# EAGLE design LPC_4TE_4.03 (EAGLE 5.04)
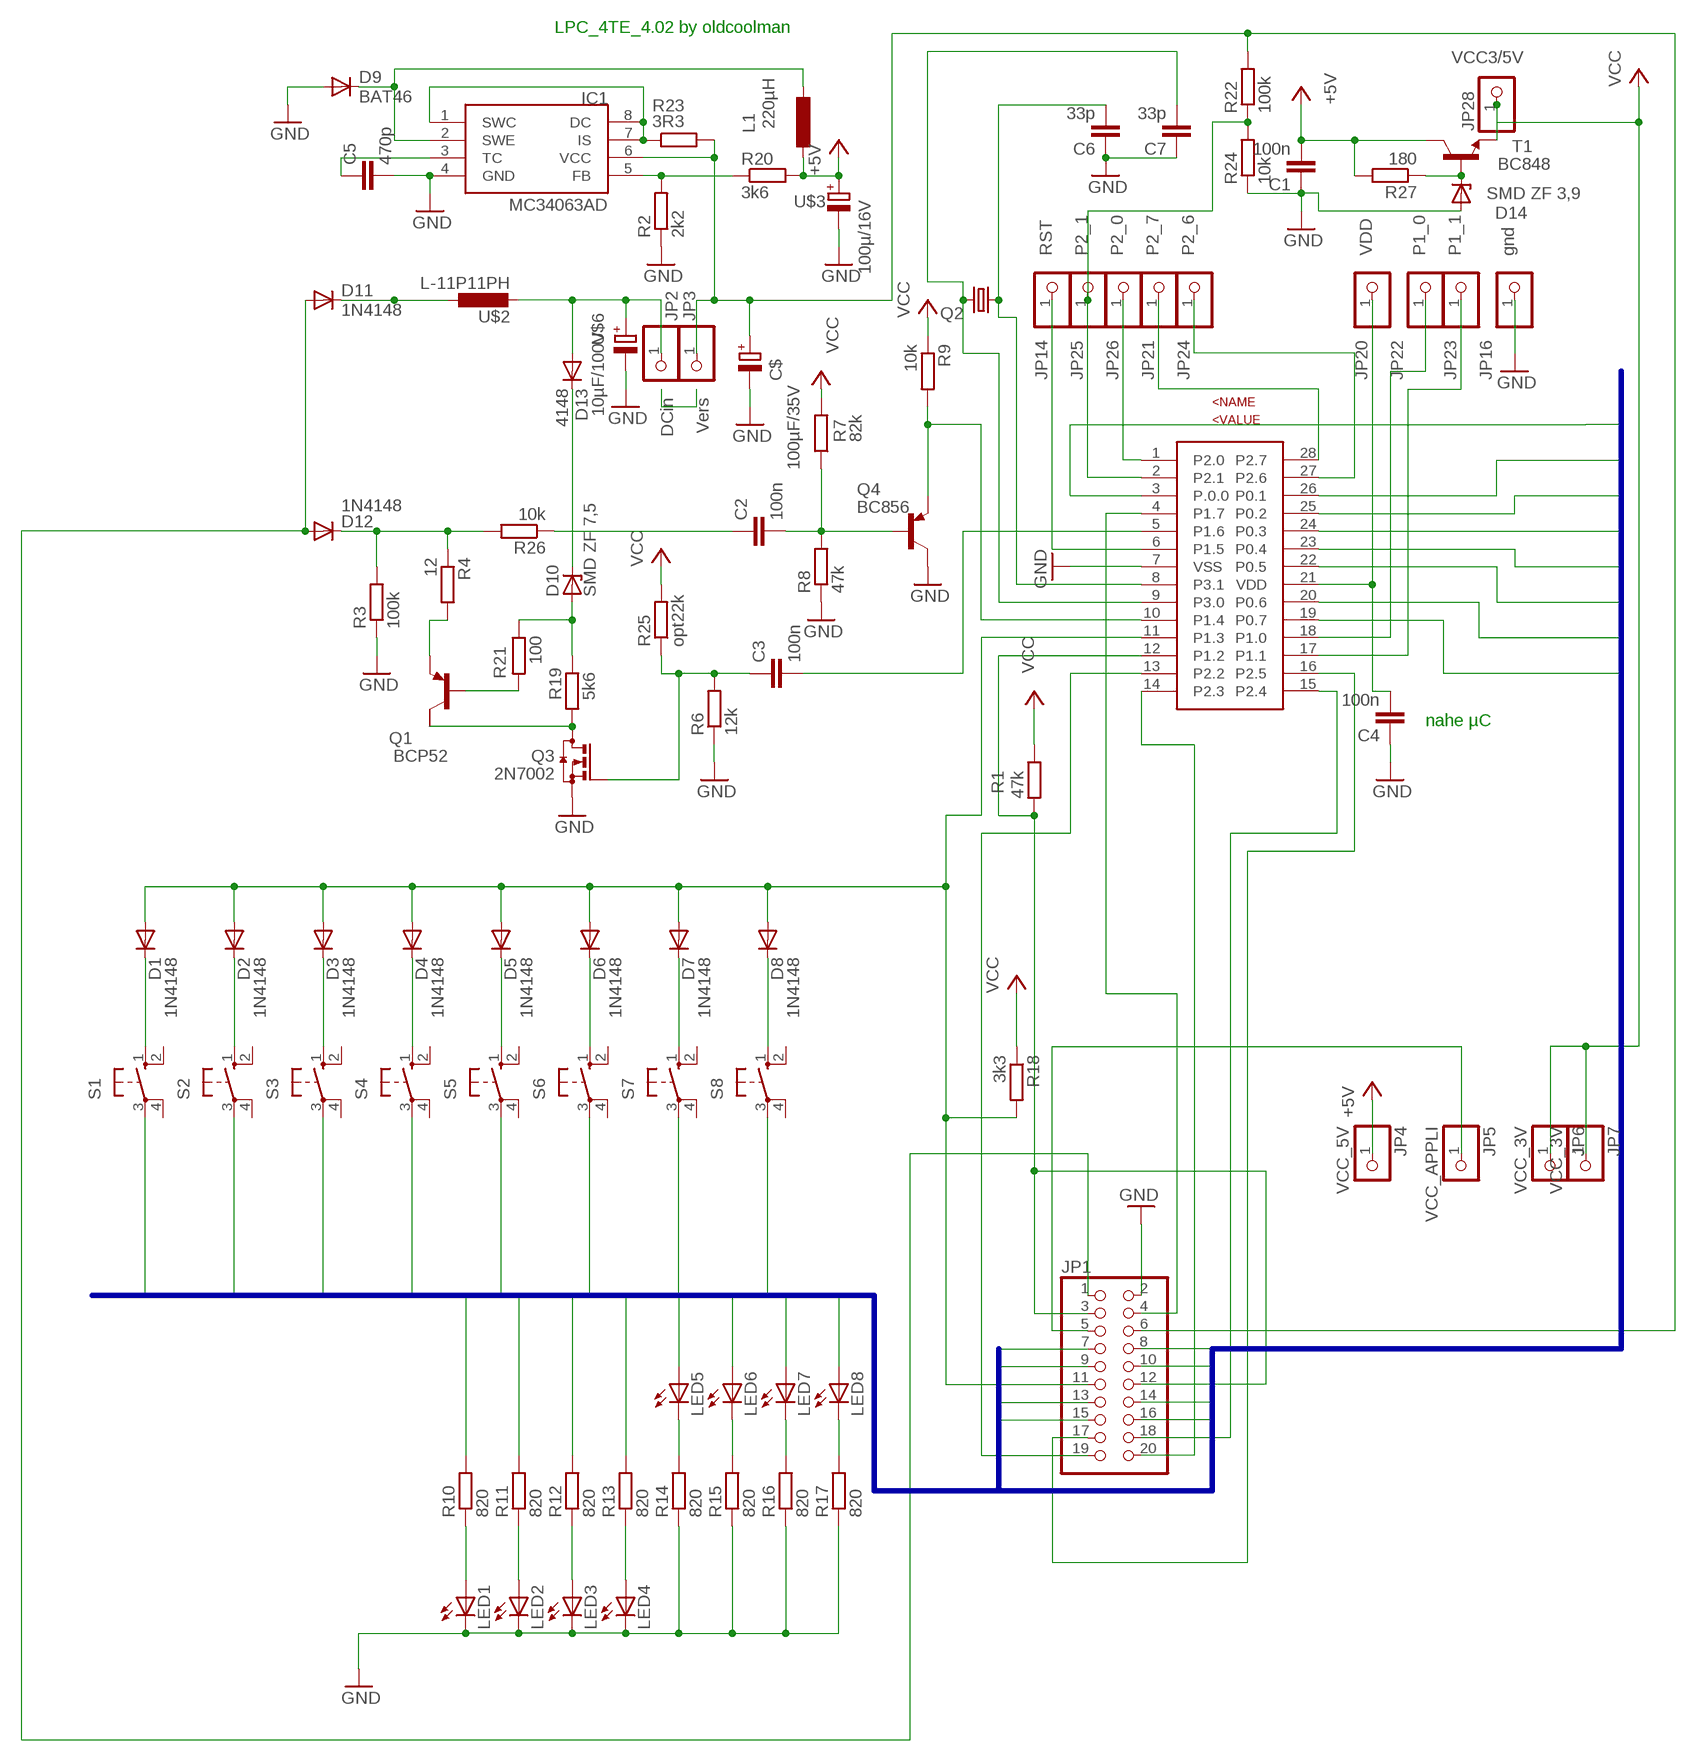
[diagram p0: schematic, sheet 1]

## Parts
C1  100n  C-EUC1206  [C1206]
C2  100n  C-EUC1206  [C1206]
C3  100n  C-EUC1206  [C1206]
C4  100n  C-EUC1206  [C1206]
C5  470p  C-EUC1206  [C1206]
C6  33p  C-EUC1206  [C1206]
C7  33p  C-EUC1206  [C1206]
C$  100µF/35V  C_EU_HE3,3X13LIEGEND  [E3,3-7,5X13]
D1  1N4148  DIODE-MINIMELF  [MINIMELF]
D2  1N4148  DIODE-MINIMELF  [MINIMELF]
D3  1N4148  DIODE-MINIMELF  [MINIMELF]
D4  1N4148  DIODE-MINIMELF  [MINIMELF]
D5  1N4148  DIODE-MINIMELF  [MINIMELF]
D6  1N4148  DIODE-MINIMELF  [MINIMELF]
D7  1N4148  DIODE-MINIMELF  [MINIMELF]
D8  1N4148  DIODE-MINIMELF  [MINIMELF]
D9  BAT46  DIODE-MINIMELF  [MINIMELF]
D10  SMD ZF 7,5  ZPD  [MINIMELF]
D11  1N4148  DIODE-MINIMELF  [MINIMELF]
D12  1N4148  DIODE-MINIMELF  [MINIMELF]
D13  4148  DIODE-MINIMELF  [MINIMELF]
D14  SMD ZF 3,9  ZPD  [MINIMELF]
IC1  MC34063AD  [SOIC8]
JP1  PINHD-2X10  [2X10]
JP2  DCin  PINHD-1X1  [1X01]
JP3  Vers  PINHD-1X1  [1X01]
JP4  VCC_5V  PINHD-1X1  [1X01]
JP5  VCC_APPLI  PINHD-1X1  [1X01]
JP6  VCC_3V  PINHD-1X1  [1X01]
JP7  VCC_3V  PINHD-1X1  [1X01]
JP14  RST  PINHD-1X1  [1X01]
JP16  gnd  PINHD-1X1  [1X01]
JP20  VDD  PINHD-1X1  [1X01]
JP21  P2_7  PINHD-1X1  [1X01]
JP22  P1_0  PINHD-1X1  [1X01]
JP23  P1_1  PINHD-1X1  [1X01]
JP24  P2_6  PINHD-1X1  [1X01]
JP25  P2_1  PINHD-1X1  [1X01]
JP26  P2_0  PINHD-1X1  [1X01]
JP28  VCC3/5V  PINHD-1X1  [1X01]
L1  220µH  L-EU2200-11.43  [2200-11.43]
LED1  LED3MM  [LED3MM]
LED2  LED3MM  [LED3MM]
LED3  LED3MM  [LED3MM]
LED4  LED3MM  [LED3MM]
LED5  LED3MM  [LED3MM]
LED6  LED3MM  [LED3MM]
LED7  LED3MM  [LED3MM]
LED8  LED3MM  [LED3MM]
Q1  BCP52  FZT753SMD  [SOT223]
Q2  CRYSTALHC49U-V  [HC49U-V]
Q3  2N7002  BSS123  [SOT23]
Q4  BC856  BC856ALT1SMD  [SOT23-BEC]
R1  47k  R-EU_M1206  [M1206]
R2  2k2  R-EU_R1206  [R1206]
R3  100k  R-EU_M1206  [M1206]
R4  12  R-EU_R1206  [R1206]
R6  12k  R-EU_R1206  [R1206]
R7  82k  R-EU_R1206  [R1206]
R8  47k  R-EU_M1206  [M1206]
R9  10k  R-EU_R1206  [R1206]
R10  820  R-EU_R1206  [R1206]
R11  820  R-EU_R1206  [R1206]
R12  820  R-EU_R1206  [R1206]
R13  820  R-EU_R1206  [R1206]
R14  820  R-EU_R1206  [R1206]
R15  820  R-EU_R1206  [R1206]
R16  820  R-EU_R1206  [R1206]
R17  820  R-EU_R1206  [R1206]
R18  3k3  R-EU_R1206  [R1206]
R19  5k6  R-EU_M1206  [M1206]
R20  3k6  R-EU_M1206  [M1206]
R21  100  R-EU_R1206  [R1206]
R22  100k  R-EU_R1206  [R1206]
R23  3R3  R-EU_M1206  [M1206]
R24  10k  R-EU_R1206  [R1206]
R25  opt22k  R-EU_R1206  [R1206]
R26  10k  R-EU_R1206  [R1206]
R27  180  R-EU_R1206  [R1206]
S1  10-XX  [B3F-10XX]
S2  10-XX  [B3F-10XX]
S3  10-XX  [B3F-10XX]
S4  10-XX  [B3F-10XX]
S5  10-XX  [B3F-10XX]
S6  10-XX  [B3F-10XX]
S7  10-XX  [B3F-10XX]
S8  10-XX  [B3F-10XX]
T1  BC848  [SOT23]
U$1  LPC936TSSOP28  [TSSOP28]
U$2  L-11P11PH  [11PH]
U$3  100µ/16V  C_EU_HE2,5-5X12MIRROR  [E2,5-5X12MIRR]
U$6  10µF/100V  C_EU_H  [E2,5-5X12]

## Nets
+5V: C1.2 JP4.1 L1.1 R20.2 R27.2 T1.3(C) U$3.+
GND: C1.1 C4.1 C5.2 C6.1 C7.1 C$.- D9.A D14.A IC1.4(GND) JP1.2 JP16.1 LED1.K(C) LED2.K(C) LED3.K(C) LED4.K(C) Q3.2(S) Q4.C R2.1 R3.1 R6.1 R8.1 R14.1 R15.1 R16.1 R17.1 R24.1 U$1.7(VSS) U$3.- U$6.-
N$1: D1.C S1.1(S)
N$2: D2.C S2.1(S)
N$3: D3.C S3.1(S)
N$4: D4.C S4.1(S)
N$5: D14.C R27.1 T1.1(B)
N$6: D5.C S5.1(S)
N$7: D6.C S6.1(S)
N$8: D7.C S7.1(S)
N$10: D8.C S8.1(S)
N$11: D13.A JP2.1 U$2.P$2 U$6.+
N$12: C$.+ IC1.6(VCC) JP1.6 JP3.1 R22.2 R23.2
N$13: JP1.5 JP5.1
N$14: LED5.K(C) R14.2
N$15: LED1.A R10.1
N$16: LED6.K(C) R15.2
N$17: LED7.K(C) R16.2
N$18: LED8.K(C) R17.2
N$19: Q4.E R9.2 U$1.10(P1.4)
N$20: LED2.A R11.1
N$21: LED3.A R12.1
N$22: LED4.A R13.1
N$23: C2.2 Q4.B R7.1 R8.2
N$24: C3.2 U$1.5(P1.6)
N$25: D12.C R3.2 R4.1 R26.2
N$26: IC1.5(FB) R2.2 R20.1
N$27: D9.C IC1.2(SWE) L1.2
N$28: C5.1 IC1.3(TC)
N$29: JP22.1 U$1.18(P1.0)
N$30: JP23.1 U$1.17(P1.1)
N$31: JP14.1 U$1.6(P1.5)
N$32: C4.2 JP20.1 U$1.21(VDD)
N$33: D1.A D2.A D3.A D4.A D5.A D6.A D7.A D8.A JP1.11 R18.2 U$1.11(P1.3)
N$34: C3.1 Q3.1(G) R6.2 R25.1
N$35: JP25.1 R22.1 R24.2 U$1.2(P2.1)
N$36: D11.C U$2.P$1
N$37: Q1.2(C) Q3.3(D) R19.1
N$38: D10.A R19.2 R21.1
N$39: Q1.3(E) R4.2
N$40: Q1.1(B) R21.2
N$41: D10.C D13.C
N$42: JP1.18 U$1.15(P2.4)
N$43: JP1.4 U$1.4(P1.7)
N$44: D11.A D12.A JP1.1
N$45: C6.2 Q2.1 U$1.8(P3.1)
N$46: C7.2 Q2.2 U$1.9(P3.0)
N$47: JP1.19 U$1.13(P2.2)
N$48: JP1.17 U$1.16(P2.5)
N$49: JP1.20 U$1.14(P2.3)
N$50: JP1.3 JP1.12 R1.2 U$1.12(P1.2)
N$51: C2.1 R26.1
N$56: JP21.1 U$1.28(P2.7)
N$57: JP24.1 U$1.27(P2.6)
N$58: JP26.1 U$1.1(P2.0)
N$61: IC1.1(SWC) IC1.7(IS) IC1.8(DC) R23.1
P0.0: JP1.7 R10.2 S1.3(P) U$1.3(P.0.0)
P0.1: JP1.8 R11.2 S2.3(P) U$1.26(P0.1)
P0.2: JP1.9 R12.2 S3.3(P) U$1.25(P0.2)
P0.3: JP1.10 R13.2 S4.3(P) U$1.24(P0.3)
P0.4: JP1.13 LED5.A S5.3(P) U$1.23(P0.4)
P0.5: JP1.14 LED6.A S6.3(P) U$1.22(P0.5)
P0.6: JP1.15 LED7.A S7.3(P) U$1.20(P0.6)
P0.7: JP1.16 LED8.A S8.3(P) U$1.19(P0.7)
VCC: JP6.1 JP7.1 JP28.1 R1.1 R7.2 R9.1 R18.1 R25.2 T1.2(E)
Unconnected: Q1.4(C/) S1.2(S1) S1.4(P1) S2.2(S1) S2.4(P1) S3.2(S1) S3.4(P1) S4.2(S1) S4.4(P1) S5.2(S1) S5.4(P1) S6.2(S1) S6.4(P1) S7.2(S1) S7.4(P1) S8.2(S1) S8.4(P1)

## Buses
P0.[0..7]

## Notes on the sheet
- LPC_4TE_4.02 by oldcoolman
- nahe µC

## Library data of the parts
C1-C7 = rcl:C-EU: CAPACITOR, European symbol
C$ U$3 U$6 = rcl:C_EU_H
D1-D9 D11-D13 = diode:DIODE-: DIODE
D10 D14 = diode:ZPD: Z DIODE 500 mW
IC1 = mc34063:MC34063
JP1 = pinhead:PINHD-2X10: PIN HEADER
JP2-JP7 JP14 JP16 JP20-JP26 JP28 = pinhead:PINHD-1X1: PIN HEADER
L1 = rcl:L-EU: INDUCTOR, European symbol
LED1-LED8 = led:LED: LED OSRAM: - CHIPLED LG R971, LG N971, LY N971, LG Q971, LY Q971, LO R971, LY R971 LH N974, LH R974 LS Q976, LO Q976, LY Q976 LO Q996 - Hyper CHIPLED LW Q18S LB Q993, LB Q99A, LB R99A - SideLED LS A670, LO A670, LY A670, LG A670, LP A670 LB A673, LV A673, LT A673, LW A673 LH A674 LY A675 LS A676, LA A676, LO A676, LY A676, LW A676 LS A679, LY A679, LG A679 - Hyper Micro SIDELED® LS Y876, LA Y876, LO Y876, LY Y876 LT Y87S - SmartLED LW L88C, LW L88S LB L89C, LB L89S, LG L890 LS L89K, LO L89K, LY L89K LS L896, LA L896, LO L896, LY L896 - TOPLED LS T670, LO T670, LY T670, LG T670, LP T670 LSG T670, LSP T670, LSY T670, LOP T670, LYG T670 LG T671, LOG T671, LSG T671 LB T673, LV T673, LT T673, LW T673 LH T674 LS T676, LA T676, LO T676, LY T676, LB T676, LH T676, LSB T676, LW T676 LB T67C, LV T67C, LT T67C, LS T67K, LO T67K, LY T67K, LW E67C LS E67B, LA E67B, LO E67B, LY E67B, LB E67C, LV E67C, LT E67C LW T67C LS T679, LY T679, LG T679 LS T770, LO T770, LY T770, LG T770, LP T770 LB T773, LV T773, LT T773, LW T773 LH T774 LS E675, LA E675, LY E675, LS T675 LS T776, LA T776, LO T776, LY T776, LB T776 LHGB T686 LT T68C, LB T68C - Hyper Mini TOPLED® LB M676 - Mini TOPLED Santana® LG M470 LS M47K, LO M47K, LY M47K Source: http://www.osram.convergy.de - LUMILED® LXK2-PW12-R00, LXK2-PW12-S00, LXK2-PW14-U00, LXK2-PW14-V00 LXK2-PM12-R00, LXK2-PM12-S00, LXK2-PM14-U00 LXK2-PE12-Q00, LXK2-PE12-R00, LXK2-PE12-S00, LXK2-PE14-T00, LXK2-PE14-U00 LXK2-PB12-K00, LXK2-PB12-L00, LXK2-PB12-M00, LXK2-PB14-N00, LXK2-PB14-P00, LXK2-PB14-Q00 LXK2-PR12-L00, LXK2-PR12-M00, LXK2-PR14-Q00, LXK2-PR14-R00 LXK2-PD12-Q00, LXK2-PD12-R00, LXK2-PD12-S00 LXK2-PH12-R00, LXK2-PH12-S00 LXK2-PL12-P00, LXK2-PL12-Q00, LXK2-PL12-R00 Source: www.luxeon.com
Q1 = transistor-pnp:FZT753SMD: PNP Transistor
Q2 = crystal:CRYSTAL: CRYSTAL
Q3 = transistor-small-signal:BSS123: N-CHANNEL MOS FET
Q4 = transistor-pnp:BC856*: PNP Transistror
R1-R4 R6-R27 = rcl:R-EU_: RESISTOR, European symbol
S1-S8 = switch-omron:10-XX: OMRON SWITCH
T1 = transistor:BC848: NPN TRANSISTOR
U$1 = freebuslpc:LPC936: C51 Based Microcontroller LPC936 ADC and 16kbyte Flash
U$2 = rcl:L-11P

## Board
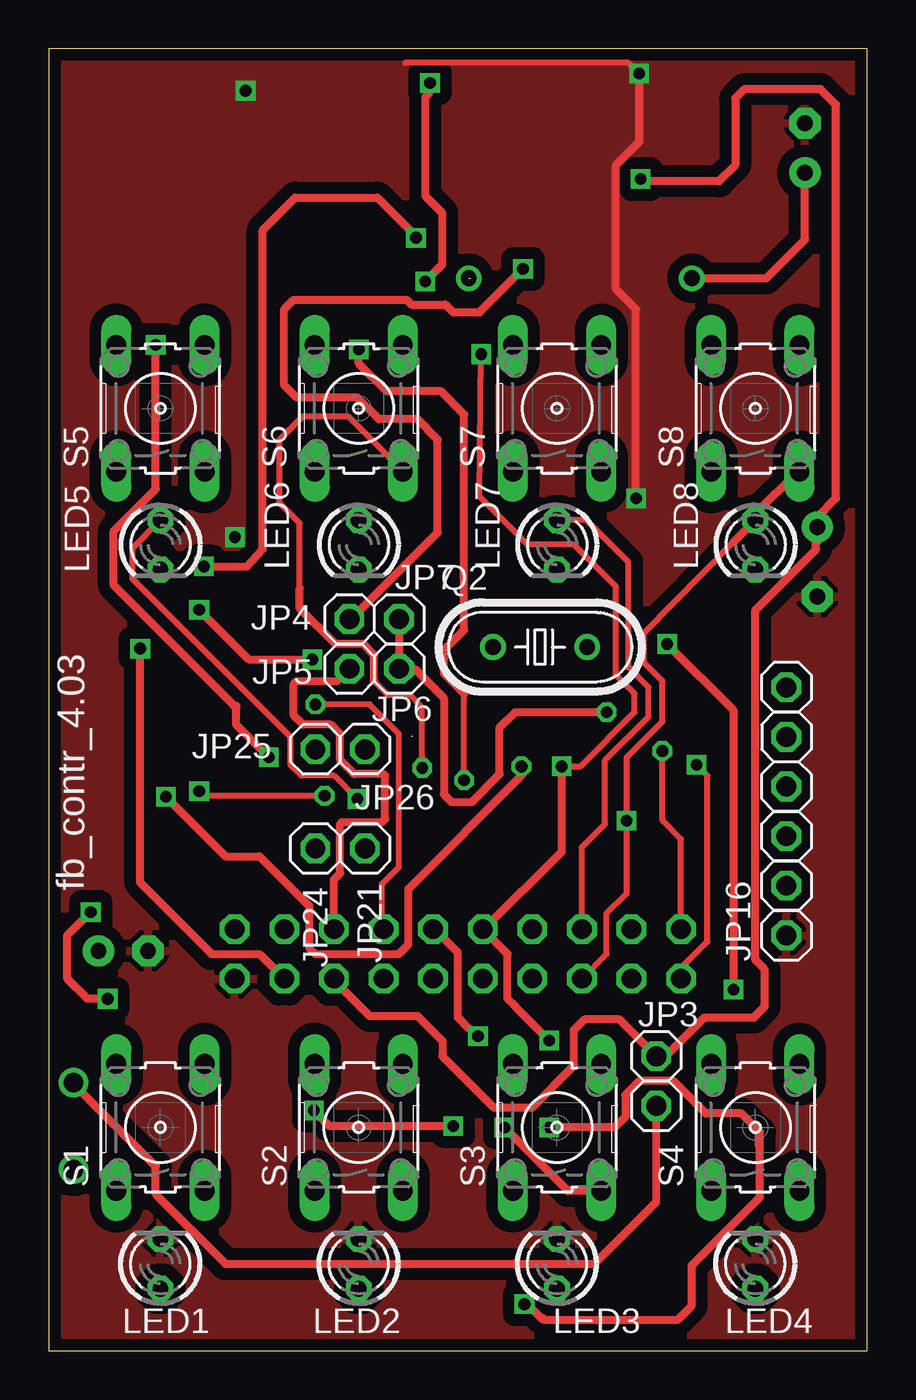
[diagram p1: board, top side]
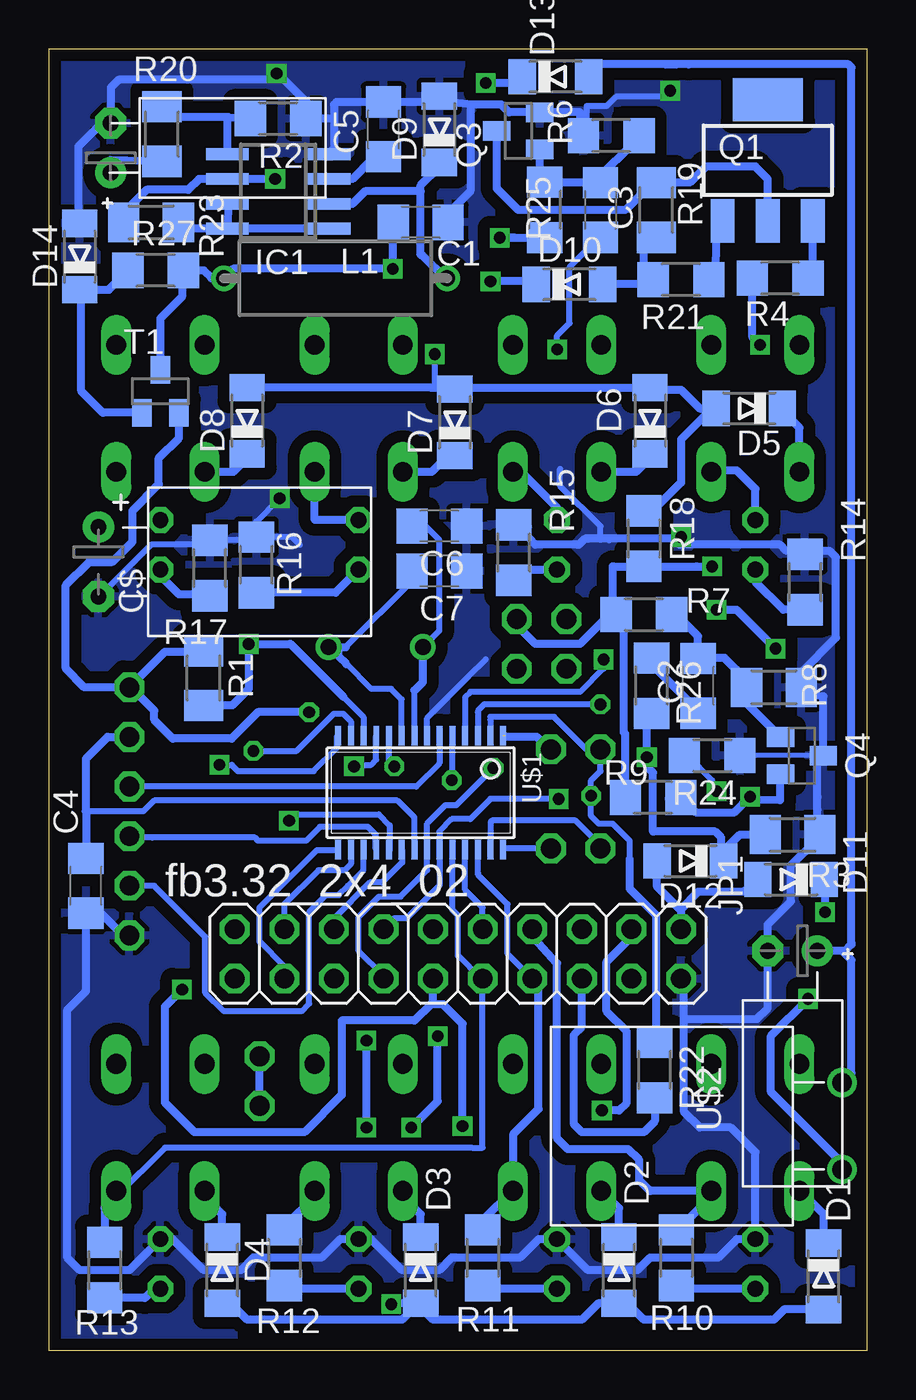
[diagram p2: board, bottom side, seen from below]

Size 41.91 x 66.67 mm. Coordinates in mm from the lower left corner, seen from the top.
Outline: 41.91,66.68 0,66.68 0,0 41.91,0 41.91,66.68
Copper layers (1*16): Top 0.035mm / dielectric 1.5mm / Bottom 0.035mm
Design rules "default *": minimum track width 10mil, minimum drill 24mil, track to track 12mil, track to pad 12mil, pad to pad 12mil, via to via 12mil, smd to smd 8mil, copper to edge 0.5mm, drill to drill 8mil, minimum pad ring 10mil, minimum via ring 8mil, stop-mask expansion 4mil, vias tented up to drill 0mil, thermal gap 10mil

### Footprints (pad centres in the part's own frame; a part is rotated, then mirrored left to right if it is on the bottom)
C1206 = smd 1.6 x 1.8: 1 -1.4,0; 2 1.4,0
E3,3-7,5X13 = drill 0.813 pad 1.6 round: + -1.778,0 | drill 0.813 pad 1.6 octagon: - 1.778,0
MINIMELF = smd 1.4 x 1.8: A 1.7,0; C -1.7,0
SOIC8 = smd 0.6 x 2.2: 1 -1.905,-2.6; 2 -0.635,-2.6; 3 0.635,-2.6; 4 1.905,-2.6; 5 1.905,2.6; 6 0.635,2.6; 7 -0.635,2.6; 8 -1.905,2.6
2X10 = drill 1.016 octagon: 1 -11.43,-1.27; 2 -11.43,1.27; 3 -8.89,-1.27; 4 -8.89,1.27; 5 -6.35,-1.27; 6 -6.35,1.27; 7 -3.81,-1.27; 8 -3.81,1.27; 9 -1.27,-1.27; 10 -1.27,1.27; 11 1.27,-1.27; 12 1.27,1.27; 13 3.81,-1.27; 14 3.81,1.27; 15 6.35,-1.27; 16 6.35,1.27; 17 8.89,-1.27; 18 8.89,1.27; 19 11.43,-1.27; 20 11.43,1.27
1X01 = drill 1.016 octagon: 1 0,0
2200-11.43 = drill 0.8 pad 1.27 round: 1 -5.715,0; 2 5.715,0
LED3MM = drill 0.813 octagon: A -1.27,0; K 1.27,0
SOT223 = smd 1.219 x 2.235: 1 -2.311,-3.099; 2 0,-3.099; 3 2.311,-3.099 | smd 3.6 x 2.2: 4 0,3.099
HC49U-V = drill 0.813 round: 1 -2.413,0; 2 2.413,0
SOT23 = smd 1 x 1.4: 1 -0.95,-1.1; 2 0.95,-1.1; 3 0,1.1
SOT23-BEC = smd 1 x 1.4: B -0.95,-1.1; C 0,1.1; E 0.95,-1.1
M1206 = smd 1.6 x 2: 1 -1.4,0; 2 1.4,0
R1206 = smd 1.6 x 1.803: 1 -1.422,0; 2 1.422,0
B3F-10XX = drill 1.016 long: 1 -3.251,2.261; 2 3.251,2.261; 3 -3.251,-2.261; 4 3.251,-2.261
TSSOP28 = smd 0.305 x 0.991: 1 -4.225,-2.918; 2 -3.575,-2.918; 3 -2.925,-2.918; 4 -2.275,-2.918; 5 -1.625,-2.918; 6 -0.975,-2.918; 7 -0.325,-2.918; 8 0.325,-2.918; 9 0.975,-2.918; 10 1.625,-2.918; 11 2.275,-2.918; 12 2.925,-2.918; 13 3.575,-2.918; 14 4.225,-2.918; 15 4.225,2.918; 16 3.575,2.918; 17 2.925,2.918; 18 2.275,2.918; 19 1.625,2.918; 20 0.975,2.918; 21 0.325,2.918; 22 -0.325,2.918; 23 -0.975,2.918; 24 -1.625,2.918; 25 -2.275,2.918; 26 -2.925,2.918; 27 -3.575,2.918; 28 -4.225,2.918
11PH = drill 1 round: P$1 -2.223,0; P$2 2.223,0
E2,5-5X12MIRR = drill 0.813 pad 1.6 round: + -1.27,0 | drill 0.813 pad 1.6 octagon: - 1.27,0
E2,5-5X12 = drill 0.813 pad 1.6 round: + -1.27,0 | drill 0.813 pad 1.6 octagon: - 1.27,0

### Placement (x,y rotation side)
C1  22.86,57.79 180 bottom
C2  8.65,34.05 90 bottom
C3  13.65,58.42 270 bottom
C4  40,23.81 90 bottom
C5  24.77,62.55 90 bottom
C6  21.91,42.23 180 bottom
C7  21.91,39.93 180 bottom
C$  39.37,40.4 270 bottom
D1  2.22,3.81 270 bottom
D2  12.7,4.13 270 bottom
D3  22.86,4.13 270 bottom
D4  33.02,4.13 270 bottom
D5  6.03,48.26 180 bottom
D6  11.11,47.62 90 bottom
D7  21.11,47.55 90 bottom
D8  31.75,47.62 90 bottom
D9  21.91,62.55 90 bottom
D10  15.24,54.61 0 bottom
D11  3.89,24.13 180 bottom
D12  9.05,25.08 180 bottom
D13  15.95,65.25 0 bottom
D14  40.32,56.04 90 bottom
IC1  30.16,59.37 90 bottom
JP1  20.95,20.32 180 bottom
JP2  31.12,12.54 0 top
JP3  31.12,15.08 0 top
JP4  15.4,37.47 0 top
JP5  15.4,34.92 0 top
JP6  17.94,34.93 0 top
JP7  17.94,37.47 0 top
JP14  37.78,28.89 270 top
JP16  37.78,21.27 90 top
JP20  37.78,31.43 0 top
JP21  16.19,25.72 270 top
JP22  37.78,26.35 90 top
JP23  37.78,23.81 270 top
JP24  13.65,25.72 270 top
JP25  13.65,30.8 270 top
JP26  16.19,30.8 270 top
JP28  37.78,33.97 270 top
L1  27.23,54.93 0 bottom
LED1  5.71,4.45 90 top
LED2  15.88,4.45 90 top
LED3  26.03,4.45 90 top
LED4  36.2,4.45 90 top
LED5  5.71,41.27 270 top
LED6  15.88,41.27 270 top
LED7  26.03,41.27 270 top
LED8  36.2,41.27 270 top
Q1  5.08,60.96 0 bottom
Q2  25.16,36.04 0 top
Q3  17.86,62.47 90 bottom
Q4  3.33,30.48 270 bottom
R1  33.97,34.45 270 bottom
R2  30.16,63.1 180 bottom
R3  3.81,26.43 180 bottom
R4  4.45,54.93 0 bottom
R6  13.1,62.23 0 bottom
R7  11.43,37.7 180 bottom
R8  4.76,33.97 180 bottom
R9  10.95,28.34 0 bottom
R10  9.76,4.76 90 bottom
R11  19.69,4.76 90 bottom
R12  29.84,4.76 90 bottom
R13  39.05,4.13 90 bottom
R14  3.18,39.37 270 bottom
R15  18.1,40.88 270 bottom
R16  31.27,40.24 270 bottom
R17  33.66,40.08 270 bottom
R18  11.43,41.59 90 bottom
R19  10.8,58.42 270 bottom
R20  36.12,62.31 270 bottom
R21  9.52,54.85 0 bottom
R22  10.87,14.37 270 bottom
R23  36.67,57.79 180 bottom
R24  7.94,30.48 180 bottom
R25  16.51,58.42 270 bottom
R26  11.03,34.05 270 bottom
R27  36.43,55.32 0 bottom
S1  5.71,11.43 90 top
S2  15.88,11.43 90 top
S3  26.03,11.43 90 top
S4  36.2,11.43 90 top
S5  5.71,48.26 90 top
S6  15.88,48.26 90 top
S7  26.03,48.26 90 top
S8  36.2,48.26 90 top
T1  36.19,49.13 0 bottom
U$1  22.86,28.58 180 bottom
U$2  1.27,11.51 90 bottom
U$3  38.73,61.59 90 bottom
U$6  3.81,20.48 180 bottom

### Tracks (layer width: path | path; a pad name or v marks a point on that pad's centre or on a via)
+5V  (via drill 0.6)
  Top 0.406: JP4.1 15.48,37.47 19.92,41.91 19.92,46.67 18.89,47.7 16.91,47.7 15.8,48.82 12.7,48.82 12.06,49.45 12.06,53.34 12.54,53.82 18.34,53.82 18.57,53.58 20.32,53.58 20.72,53.18 22.07,53.18 v24.29,55.4 | L1.1 36.75,54.93 38.73,56.91 U$3.+
  Bottom 0.406: R20.2 38.76,60.99 U$3.+ | C1.2 24.29,57.76 v24.29,55.4 32.46,55.4 L1.1 33.58,54.93 33.97,55.32 R27.2 35.08,55.25 35.08,53.97 36.2,52.86 T1.3
GND  (via drill 0.6)
  Top 0.305: 18.26,65.96 29.69,65.96 v30.24,65.41
  Top 0.406: v30.24,65.41 30.24,61.91 29.05,60.72 29.05,54.37 30.08,53.34 v30.08,43.66
  Bottom 0.254: Q4.C R24.1
  Bottom 0.305: 39.37,37.94 C$.- 39.32,38.62 36.67,41.27 33.89,41.27 R17.1 31.43,41.51 R16.1 | U$1.7 22.53,32.39 20.4,34.53 | Q4.C 2.22,30.48 | 20.4,34.53 | 20.4,34.53 19.53,35.4 | C6.1 20.72,42.52 20.72,42.15 | R15.1 18.55,42.75 | 29.05,41.27 29.44,41.67 R16.1 | v30.08,43.66 31.27,42.47 R16.1 | v10.08,64.53 10.4,64.21 12.86,64.21 13.34,63.74 14.37,63.74 14.37,62.47 | 15.72,45.16 15.72,44.29 13.65,42.23 13.65,41.59
  Bottom 0.406: 27.3,63.82 27.3,63.1 R2.1 28.89,63.18 28.58,63.5 28.58,63.82 29.84,65.09 38.34,65.09 38.73,64.69 U$3.- 39.21,62.87 40.4,61.67 40.4,57.82 D14.A | 27.3,63.82 27.17,63.95 C5.2 22.41,63.95 22.11,64.25 D9.A | C1.1 21.46,58.23 20.32,59.37 20.32,63.82 20.24,63.82 | IC1.4 27.62,61.28 27.3,61.59 27.3,63.82 | 9.37,16.99 9.37,12.22 8.57,11.43 6.98,11.43 5.71,10.16 LED1.K 6.67,5.72 7.62,4.76 11.11,4.76 11.75,4.13 14.29,4.13 LED2.K 16.83,5.72 17.78,4.76 21.27,4.76 21.91,4.13 23.81,4.13 25.4,5.72 LED3.K 26.99,5.72 27.94,4.76 31.43,4.76 32.07,4.13 33.97,4.13 35.56,5.72 LED4.K 37.78,4.13 40.32,4.13 40.96,4.76 40.96,17.46 40,18.42 C4.1 39.24,22.41 38.1,21.27 JP16.1 | 9.37,16.99 9.37,18.81 9.52,18.97 JP1.2 | 2.54,26.19 2.49,26.38 R3.1 2.46,26.27 2.54,26.19 | 3.18,40.96 R14.1 | 3.18,40.96 1.91,40.96 1.59,40.64 1.59,36.51 3.36,34.74 R8.1 3.36,33.79 3.49,33.65 2.23,33.51 Q4.C 2.54,30.48 2.54,28.34 2.54,27.7 2.54,26.19 | 3.18,40.96 4.13,40.96 4.45,41.27 9.6,41.27 9.92,41.59 13.18,41.59 | 2.54,26.19 | 13.18,41.59 13.65,41.59 14.29,41.59 14.45,41.59 14.76,41.27 14.84,41.27 16.99,41.27 17.94,42.31 R15.1 | 13.18,41.59 13.21,41.56 | 2.54,26.19 3.89,24.84 3.89,23.02 5.08,21.83 U$6.- 5.08,17.54 5.64,16.99 9.37,16.99 | R6.1 14.68,62.23 14.68,63.42 17,63.42 | 17,63.42 Q3.2 | D9.A 21.87,64.21 | C$.- 39.09,38.34 | 17,63.42 18.34,63.42 18.73,63.82 20.24,63.82 | 20.24,63.82 21.64,63.98 D9.A
  other vias: 9.52,41.67
  pour Bottom (isolate 0.61): 0,66.83 0,0.16 42.07,0.16 42.07,66.83 0.63,66.83
  pour Top (isolate 0.61): 0,66.52 0,0.16 42.07,0.16 42.07,66.67 0.95,66.67
N$1
  Bottom 0.406: 3.45,8.22 3.49,8.25 | 3.45,8.22 S1.1 | D1.C 2.22,6.98 3.45,8.22
N$2
  Bottom 0.406: 13.61,8.22 13.65,8.25 | 13.61,8.22 S2.1 | D2.C 12.7,7.3 13.61,8.22
N$3
  Bottom 0.406: S3.1 23.77,7.98 23.81,7.94 22.86,6.98 D3.C
N$4
  Bottom 0.406: S4.1 33.93,7.98 33.97,7.94 33.02,6.98 D4.C
N$5
  Bottom 0.406: R27.1 38.84,54.34 D14.C 40.24,54.26 40.24,49.13 39.14,48.03 T1.1
N$6
  Bottom 0.406: D5.C 4.45,48.26 3.45,47.27 S5.1
N$7
  Bottom 0.406: D6.C 11.11,45.72 11.82,45.01 S6.1
N$8
  Bottom 0.406: D7.C 21.59,45.72 22.3,45.01 S7.1
N$10
  Bottom 0.406: D8.C 31.75,45.72 32.46,45.01 S8.1
N$11
  Top 0.406: JP2.1 31.12,7.62 27.94,4.44 9.05,4.44 5.48,8.02 5.48,9.45 1.35,13.57 U$2.P$2
  Bottom 0.406: 9.13,65.88 0.95,65.88 0.79,65.72 0.79,20.8 | 9.13,65.88 10.32,65.88 | 0.79,20.8 0.79,20.88 | 10.32,65.88 | 0.79,20.8 1.11,20.48 1.19,20.48 | 1.19,20.48 U$6.+ | U$2.P$2 0.79,14.21 0.79,20 1.19,20.4 1.19,20.48 | 10.32,65.88 9.76,65.88 | 9.13,65.88 | 10.32,65.88 13.62,65.88 D13.A | JP2.1 31.12,15.08
N$12  (via drill 0.6)
  Top 0.406: JP3.1 31.59,15.08 33.58,17.07 36.12,17.07 36.67,17.62 36.67,19.53 36.2,20 36.2,37.94 39.29,41.04 39.29,41.35 39.37,41.43 39.37,41.67 | 39.37,41.67 C$.+ | JP1.6 14.6,18.97 16.43,17.15 18.89,17.15 20.16,15.87 20.16,15.08 22.78,12.46 24.77,12.46 26.91,14.6 26.91,16.43 27.46,16.99 29.21,16.99 JP3.1 | JP3.1 | 39.37,41.67 39.37,42.7 40.32,43.66 40.32,63.82 39.53,64.61 35.64,64.61 35.16,64.13 35.16,60.72 34.33,59.89 30.44,59.89 v30.32,60.01
  Bottom 0.406: C$.+ 39.37,41.67 | 38.55,57.81 38.5,57.86 | 38.55,57.81 R23.2 38.58,57.79 | 38.58,57.79 38.55,57.81 | 38.58,57.79 36.91,59.45 34.77,59.45 34.21,60.01 IC1.6 v30.32,60.01 | R22.2 10.87,11.75 11.43,11.19 14.6,11.19 15,11.59 15,16.19 14.6,16.59 JP1.6
N$13
  Top 0.406: JP1.5 14.6,24.13 14.92,24.45 14.92,26.99 15,27.07 17.07,27.07 17.22,27.23 17.22,29.45 17.14,29.53 15.64,29.53 14.92,30.24 14.92,31.59 14.45,32.07 13.02,32.07 12.54,32.54 12.54,34.13 12.7,34.29 14.76,34.29 JP5.1
N$14
  Bottom 0.406: R14.2 4.29,37.95 5.71,39.37 LED5.K 5.71,40.32
N$15
  Bottom 0.406: R10.1 9.37,3.34 9.37,3.18 LED1.A
N$16
  Bottom 0.406: R15.2 17.87,39.46 17.86,39.45 17.3,40.01 LED6.K
N$17
  Bottom 0.406: LED7.K 27.22,38.82 R16.2
N$18
  Bottom 0.406: R17.2 33.73,38.73 35.24,38.73 36.2,39.69 LED8.K
N$19  (via drill 0.6)
  Top 0.406: v5.99,28.38 9.05,25.32 10.8,25.32 13.34,22.78 13.34,20.64 13.65,20.32 17.94,20.32 18.41,20.8 18.41,23.65 24.21,29.45 v24.21,29.92
  Bottom 0.305: v24.21,29.92 24.48,30.2 U$1.10
  Bottom 0.406: 10.16,28.26 R9.2 8.73,27.54 6.83,27.54 v5.99,28.38 6.03,28.22 | 6.03,28.22 6.03,28.18 | Q4.E 4.45,28.18 6.03,28.22
N$20
  Bottom 0.406: R11.1 19.69,3.18 LED2.A
N$21
  Bottom 0.406: R12.1 29.69,3.34 29.53,3.18 LED3.A
N$22
  Bottom 0.406: LED4.A 36.51,3.18 36.98,2.71 R13.1
N$23
  Bottom 0.406: 5.4,32.38 Q4.B 5.71,32.7 6.16,33.15 R8.2 6.16,34.34 7.3,35.48 8.49,35.48 8.52,35.45 C2.2 8.65,35.48 | R7.1 9.76,37.7 8.65,36.59 8.65,35.48 | 8.65,35.48
N$24  (via drill 0.6)
  Top 0.305: v21.27,29.21 21.27,33.65
  Top 0.406: 21.27,33.65 20.24,34.69 20.24,35.88 21.27,36.91 21.27,47.94 20.08,49.13 17.3,49.13 15.88,50.56 v15.88,51.28
  Bottom 0.305: U$1.5 21.23,29.25 v21.27,29.21 | v15.88,51.28 15.88,51.99 15.24,52.63 15.24,55.48 13.7,57.02 C3.2
N$25  (via drill 0.6)
  Top 0.406: 9.6,32.94 9.6,32.07 v11.27,30.4 | 9.6,32.94 9.6,33.02 | v5.48,51.51 5.48,44.13 3.33,41.99 3.33,39.21 9.6,32.94
  Bottom 0.406: R3.2 6.51,26.43 7.38,25.56 D12.C 7.38,25 7.46,25.08 7.46,26.27 7.78,26.59 10.95,26.59 10.95,29.61 11.27,29.92 v11.27,30.4 11.27,32.63 R26.2 | R4.1 5.87,51.9 v5.48,51.51
N$26
  Bottom 0.406: R20.1 36.2,63.18 32.7,63.18 | 32.7,63.18 R2.2 | IC1.5 32.76,63.12 32.7,63.18
N$27  (1 unrouted)
  Bottom 0.406: D9.C 21.91,60.64 22.86,59.69 22.86,59.37 | 22.86,59.37 22.86,56.12 22.78,56.12 21.59,54.93 | IC1.2 26.35,58.74 25.72,59.37 22.86,59.37
N$28
  Bottom 0.406: IC1.3 26.35,60.01 25.4,60.96 24.77,60.96 C5.1
N$29
  Bottom 0.305: JP22.1 37.7,26.27 36.59,26.27 31.35,26.27 31.19,26.11 28.73,26.11 28.02,26.83 25.56,26.83 25.16,26.43 25.16,25.72 25.13,25.69 U$1.18
N$30
  Bottom 0.305: U$1.17 25.8,25.64 25.8,24.61 26.59,23.81 27.07,23.34 27.7,23.34 28.58,22.46 28.58,17.78 28.97,17.38 32.94,17.38 33.89,18.34 33.89,21.19 36.51,23.81 JP23.1
N$31
  Bottom 0.305: JP14.1 23.1,28.89 21.91,30.08 21.91,31.35 21.91,31.43 U$1.6
N$32
  Bottom 0.305: U$1.21 23.19,27.31 24.05,28.18 36.51,28.18 37.07,27.62 40,27.62 40.08,27.62
  Bottom 0.406: C4.2 40,27.62 40,30.32 38.89,31.43 JP20.1
N$33  (via drill 0.6)
  Top 0.305: JP1.11 22.23,21.51 | v26.27,29.92 | v26.27,29.92 26.91,29.92 27.23,29.92 30,32.7 30,33.66 29.05,34.61 29.05,39.13 27.86,40.32 | 23.49,42.31 22.07,43.74 v22.15,51.04 | 23.49,42.31 | 23.49,42.31 24.53,41.27 26.91,41.27 27.86,40.32 | 27.86,40.32
  Top 0.406: v24.37,2.38 24.53,2.38 25.32,1.59 25.32,1.67 25.4,1.59 32.23,1.59 32.94,2.3 32.94,4.37 36.43,7.86 36.43,11.19 35.48,12.14 33.66,12.14 31.99,13.81 30.24,13.81 29.53,13.1 29.53,11.99 28.97,11.43 v25.64,11.43 | 23.49,18.02 23.49,20.32 JP1.11 22.3,21.59 26.27,25.56 v26.27,29.92 | 23.49,18.02 | 23.49,18.02 23.89,17.62 23.97,17.54 v25.64,15.87
  Bottom 0.305: U$1.11 25.13,30.27 25.4,30 26.19,30 v26.27,29.92 | 22.38,49.33 22.15,49.29 v22.15,51.04
  Bottom 0.406: D1.A 4.24,2.11 4.76,1.59 11.43,1.59 12.06,2.22 12.38,2.22 12.49,2.11 D2.A 13.77,2.43 14.6,1.59 22.23,1.59 22.86,2.22 D3.A | D3.A 22.97,2.43 23.81,1.59 31.75,1.59 32.7,2.54 32.81,2.43 D4.A | R18.2 10.96,43.01 9.52,44.45 9.52,46.67 7.94,48.26 D5.A 8.57,48.26 9.52,49.21 10.8,49.21 10.91,49.33 D6.A 21.38,49.33 21.59,49.53 D7.A 21.59,49.21 21.7,49.33 22.38,49.33 D8.A | D3.A 24.32,2.43 v24.37,2.38 | v25.64,11.43 v25.64,15.87
N$34
  Bottom 0.406: Q3.1 16.76,60.5 16.27,60.01 R25.1 16.43,59.93 16.32,59.82 C3.1 13.65,60.17 12.07,61.75 R6.2 12.07,62.15 11.99,62.15
N$35  (via drill 0.6)
  Top 0.305: v7.7,28.65 8.1,28.42 v14.13,28.42
  Bottom 0.305: U$1.2 19.28,32.3 19.29,32.31 19.29,32.46 16.03,32.46 14.37,30.8 JP25.1 | JP25.1 13.57,30.8 | 12.14,25.16 12.14,26.11 13.02,26.99 13.73,26.99 14.13,27.38 14.13,28.34 v14.13,28.42 14.13,29.21 13.65,29.69 JP25.1 | R24.2 9.21,30.48 7.94,29.21 7.94,28.73 v7.7,28.65
  Bottom 0.406: 12.14,25.16 12.14,23.65 10.8,22.3 10.8,15.95 10.87,15.87 R22.1
N$36  (via drill 0.6)
  Top 0.406: v3.02,18.02 1.98,18.02 0.95,19.05 0.95,21.27 v2.14,22.46
  Bottom 0.406: 2.14,23.57 2.14,23.78 D11.C 2.14,24.13 v2.14,22.46 | U$2.P$1 1.27,9.6 4.92,13.26 4.92,16.11 v3.02,18.02
N$37
  Bottom 0.406: Q3.3 18.96,59.52 17.86,58.42 12.38,58.42 10.98,59.82 R19.1 9.08,59.82 8.26,60.64 5.71,60.64 5.08,60.01 Q1.2 5.08,58.1
N$38
  Bottom 0.406: R21.1 11.43,54.61 | 11.43,54.61 D10.A | R19.2 10.92,57.02 11.43,56.51 11.43,54.61
N$39
  Bottom 0.406: R4.2 2.93,55.08 2.78,54.93 2.77,57.24 Q1.3
N$40
  Bottom 0.406: R21.2 7.73,54.8 7.71,57.24 Q1.1
N$41  (via drill 0.6)
  Top 0.406: v19.53,64.93 19.53,64.45 19.29,64.21 19.29,59.13 20.16,58.26 20.16,55.64 v19.29,54.77
  Bottom 0.406: D13.C 17.86,64.93 v19.53,64.93 | v19.29,54.77 17.1,54.77 D10.C
N$42
  Bottom 0.305: U$1.15 27.1,25.64 28.18,25.64 31.12,22.7 31.12,20.96 29.84,19.69 JP1.18
N$43  (via drill 0.6)
  Top 0.406: v13.49,35.4 10.24,35.4 v7.7,37.94 | JP1.4 12.14,19.05 11.75,19.37 10.8,20.32 9.37,20.32 8.33,20.32 4.68,23.97 v4.68,35.96
  Bottom 0.305: U$1.4 20.59,33.47 20.32,33.73 14.68,33.73 13.49,34.93 v13.49,35.4
  Bottom 0.406: v7.7,37.94 6.67,37.94 v4.68,35.96
N$44
  Bottom 0.406: D12.A 10.75,23.77 9.56,22.58 | 9.56,22.58 9.52,22.54 JP1.1 | D11.A 5.95,23.81 6.35,23.49 8.65,23.49 9.56,22.58
N$45
  Bottom 0.305: U$1.8 23.19,31.5 23.18,31.51 23.18,33.81 | Q2.1 21.91,36.88 21.91,41.51 22.62,42.23 C6.2
  Bottom 0.406: 23.18,33.81 22.75,34.24 Q2.1
N$46
  Bottom 0.305: U$1.9 23.84,33.36 24.37,33.89 25.4,33.89 26.67,35.16 | 26.7,36.04 23.31,39.43 C7.2
  Bottom 0.406: 27.07,36.04 Q2.2 | 27.07,36.04 26.7,36.04 | 26.67,35.16 27.07,35.56 27.07,36.04
N$47  (via drill 0.6)
  Top 0.305: v31.43,30.72 31.43,27.15 32.38,26.19 JP1.19
  Bottom 0.305: U$1.13 26.43,32.23 26.83,32.62 27.3,32.62 29.21,30.72 v31.43,30.72 31.04,30.72
N$48
  Bottom 0.305: U$1.16 26.43,24.92 26.75,24.61 28.1,24.61 29.84,22.86 JP1.17
N$49  (via drill 0.6)
  Top 0.305: v33.18,30 33.73,29.45 33.73,20.96 32.38,19.61 JP1.20 32.38,18.89
  Bottom 0.305: U$1.14 27.14,31.43 27.14,30.88 28.34,29.69 32.23,29.69 32.54,30 v33.18,30
N$50  (via drill 0.6)
  Top 0.406: v35.08,18.49 35.08,32.78 v31.67,36.19 | v20.72,11.51 15.8,11.51 14.37,11.51 v13.57,12.3
  Bottom 0.305: U$1.12 25.78,31.58 25.8,31.59 25.8,32.46 26.83,33.5
  Bottom 0.406: JP1.12 22.23,17.86 22.34,17.74 | 22.34,17.74 23.18,16.91 26.91,16.91 26.91,13.1 28.81,11.19 34.45,11.19 35.96,12.7 35.96,17.62 v35.08,18.49 | 22.34,17.74 21.71,17.74 20.72,16.75 v20.72,11.51 | 26.83,33.5 26.99,33.65 29.53,36.19 v31.67,36.19 31.67,33.89 32.52,33.05 R1.2 | JP1.3 12.06,21.19 13.34,19.92 13.34,17.38 12.3,16.35 12.3,12.7 12.7,12.3 v13.57,12.3 13.65,12.3
N$51
  Bottom 0.406: 11.03,35.16 | 11.03,35.16 R26.1 | C2.1 8.65,32.78 11.03,35.16
N$56
  Bottom 0.305: U$1.28 18.57,25.72 JP21.1
N$57
  Bottom 0.305: U$1.27 19.28,27.07 19.21,27.15 14.92,27.15 13.65,25.88 JP24.1
N$58  (1 unrouted)
  Bottom 0.406: JP26.1 16.27,30.8 16.91,31.43 18.49,31.43 18.55,31.49
N$61
  Bottom 0.406: IC1.1 IC1.8 | IC1.7 32.7,58.58 32.72,57.72 IC1.8 | 35.72,57.55 R23.1 35.48,57.79 35.16,57.47 IC1.8
P0.0  (via drill 0.6)
  Top 0.305: v13.65,33.1 16.43,33.1 17.94,31.59 17.94,24.77 17.07,23.89 17.07,21.75 17.14,21.67 JP1.7
  Bottom 0.305: U$1.3 19.94,32.69 19.92,32.7 19.92,32.78 19.61,33.1 v13.65,33.1
  Bottom 0.406: R10.2 9.52,6.35 7.94,7.94 7.98,7.98 S1.3 11.12,8.18 11.67,8.73 11.67,9.76 12.22,10.32 15.32,10.32 15.88,10.87 15.88,19.84 16.83,20.88 17.14,21.19 JP1.7
P0.1
  Bottom 0.305: U$1.26 19.94,24.46 19.92,24.45 19.92,24.37 18.41,22.86 18.41,20.32 JP1.8
  Bottom 0.406: 18.14,8.22 18.1,8.25 18.1,11.11 16.83,12.38 16.83,18.73 JP1.8 | S2.3 18.14,8.22 | R11.2 19.69,6.67 18.14,8.22
P0.2  (via drill 0.6)
  Top 0.406: S3.3 26.59,8.18 23.42,11.35 23.42,11.43 v23.34,11.43 | v21.99,16.11 21.51,16.51 20.95,17.07 20.95,20.4 19.76,21.59 JP1.9
  Bottom 0.305: U$1.25 20.59,23.6 19.69,22.7 JP1.9
  Bottom 0.406: S3.3 28.3,7.98 28.26,7.94 29.84,6.35 R12.2 | v23.34,11.43 22.23,12.54 21.99,12.78 v21.99,16.11
P0.3
  Bottom 0.305: U$1.24 21.23,22.58 20.95,22.3 20.95,20.24 19.76,19.05 JP1.10 19.69,10.4 20.24,10.4 35.96,10.4 38.46,7.9 S4.3
  Bottom 0.406: S4.3 38.46,7.98 38.42,7.94 39.05,7.3 R13.2
P0.4  (via drill 0.6)
  Top 0.305: v15.8,28.26 14.6,29.45 12.94,29.45 12.38,30 12.38,31.43 4.29,39.53 4.29,41.12 LED5.A
  Bottom 0.305: JP1.13 24.21,22.15 23.57,22.15 21.88,23.83 U$1.23 21.88,26.14 21.91,26.11 21.91,26.59 21.27,27.23 20.32,27.23 19.29,28.26 v15.8,28.26
  Bottom 0.406: LED5.A 5.71,44.13 6.67,45.08 7.94,45.08 7.98,45.05 S5.3
P0.5  (via drill 0.6)
  Top 0.305: v19.13,29.85 19.13,30.48 19.13,32.94 18.49,33.58 17.38,33.58 16.67,34.29 | S6.3 18.14,45.05 15.32,47.86 13.02,47.86 11.83,46.67 11.83,43.42 12.86,42.39 12.86,39.05
  Top 0.406: 16.67,34.29 16.67,35.64 16.11,36.19 14.68,36.19 12.86,38.02 12.86,39.05
  Bottom 0.305: JP1.14 24.77,19.21 26.03,20.48 26.03,22.22 25,23.26 23.89,23.26 22.53,24.61 U$1.22 22.53,26.99 21.59,27.94 21.03,27.94 v19.13,29.85
  Bottom 0.406: S6.3 17.7,45.01 15.88,43.18 LED6.A
P0.6
  Top 0.305: 28.58,41.51 27.54,42.55 LED7.A | JP1.15 27.3,25.8 28.5,26.99 28.5,30.24 30.72,32.46 30.72,33.97 29.69,35 29.69,40.4 28.58,41.51 | 28.58,41.51
  Bottom 0.305: JP1.15 27.3,22.15 25.48,23.97 24.84,23.97 24.48,24.33 23.81,25 23.81,25.64 U$1.20
  Bottom 0.406: S7.3 28.3,42.55 LED7.A
P0.7  (via drill 0.6)
  Top 0.305: JP1.16 28.58,20.32 28.58,22.38 29.61,23.42 v29.61,27.15 29.61,30.4 31.43,32.23 31.43,34.29 30.48,35.24 30.48,35.64 30.48,36.75 35.08,41.43
  Top 0.406: S8.3 38.46,45.05 38.42,45.08 36.2,42.86 LED8.A 35.08,41.43 | JP1.16 27.3,18.97
  Bottom 0.305: v29.61,27.15 29.13,27.46 25,27.46 24.45,26.91 24.45,25.64 24.47,25.64 U$1.19
VCC  (via drill 0.6)
  Top 0.406: v18.81,57 18.81,57.07 16.83,59.05 12.62,59.05 10.95,57.39 10.95,41.04 10.16,40.16 v7.94,40.16 7.94,40.08 | v28.58,32.7 23.89,32.7 23.1,31.91 23.1,29.53 21.67,28.1 20.64,28.1 20.24,28.5 20.24,33.42 18.73,34.93 JP6.1 17.94,37.39 JP7.1
  Bottom 0.406: v18.81,57 18.01,57 | 18.01,57 R25.2 | R18.1 8.74,40.17 v7.94,40.16 | R18.1 11.52,40.17 | R9.1 12.38,29.69 12.38,29.92 12.38,31.59 12.46,31.67 12.46,37.31 R7.2 | 18.01,57 18.74,57 18.81,57.07 | R1.1 33.97,35.8 35.96,35.8 JP28.1 | R7.2 | R7.2 13.02,37.87 | JP28.1 37.7,33.97 36.51,32.78 36.51,32.31 35.56,31.35 32.54,31.35 31.19,32.7 v28.58,32.7 28.5,32.86 | 13.02,37.87 13.02,40.16 13.01,40.17 R18.1 | 13.02,37.87 14.69,36.19 16.99,36.19 17.94,37.15 JP7.1 | T1.2 35.24,46.75 36.27,45.72 36.27,44.37 37.62,43.02 37.62,41.43 38.66,40.4 39.85,40.4 41.04,39.21 41.04,34.93 40.08,33.97 JP28.1

### Text on the board
bPlace: fb3.32_2x4_02
tNames: fb_contr_4.03